# Altium schematic sheet FMC_connector.SchDoc: FMC DAC 1.5GS 4CH
size 420 x 297 mm; Author: G.Kasprowicz; CompanyName: WUT ISE; DrawnBy: G.Kasprowicz; Organization: WUT ISE; Address1: PW ISE; Address2: Nowowiejska 15/19 00-665 Warsaw; Address3: gkasprow@gmail.com; Revision: 1; SheetNumber: 18; SheetTotal: 18; ModifiedBy: -; CheckedDate: -; Title2: FMC; DivGrp: WUT ISE; Designer: G.Kasprowicz; ModifiedDate: -; ProjectName: Sensor Box
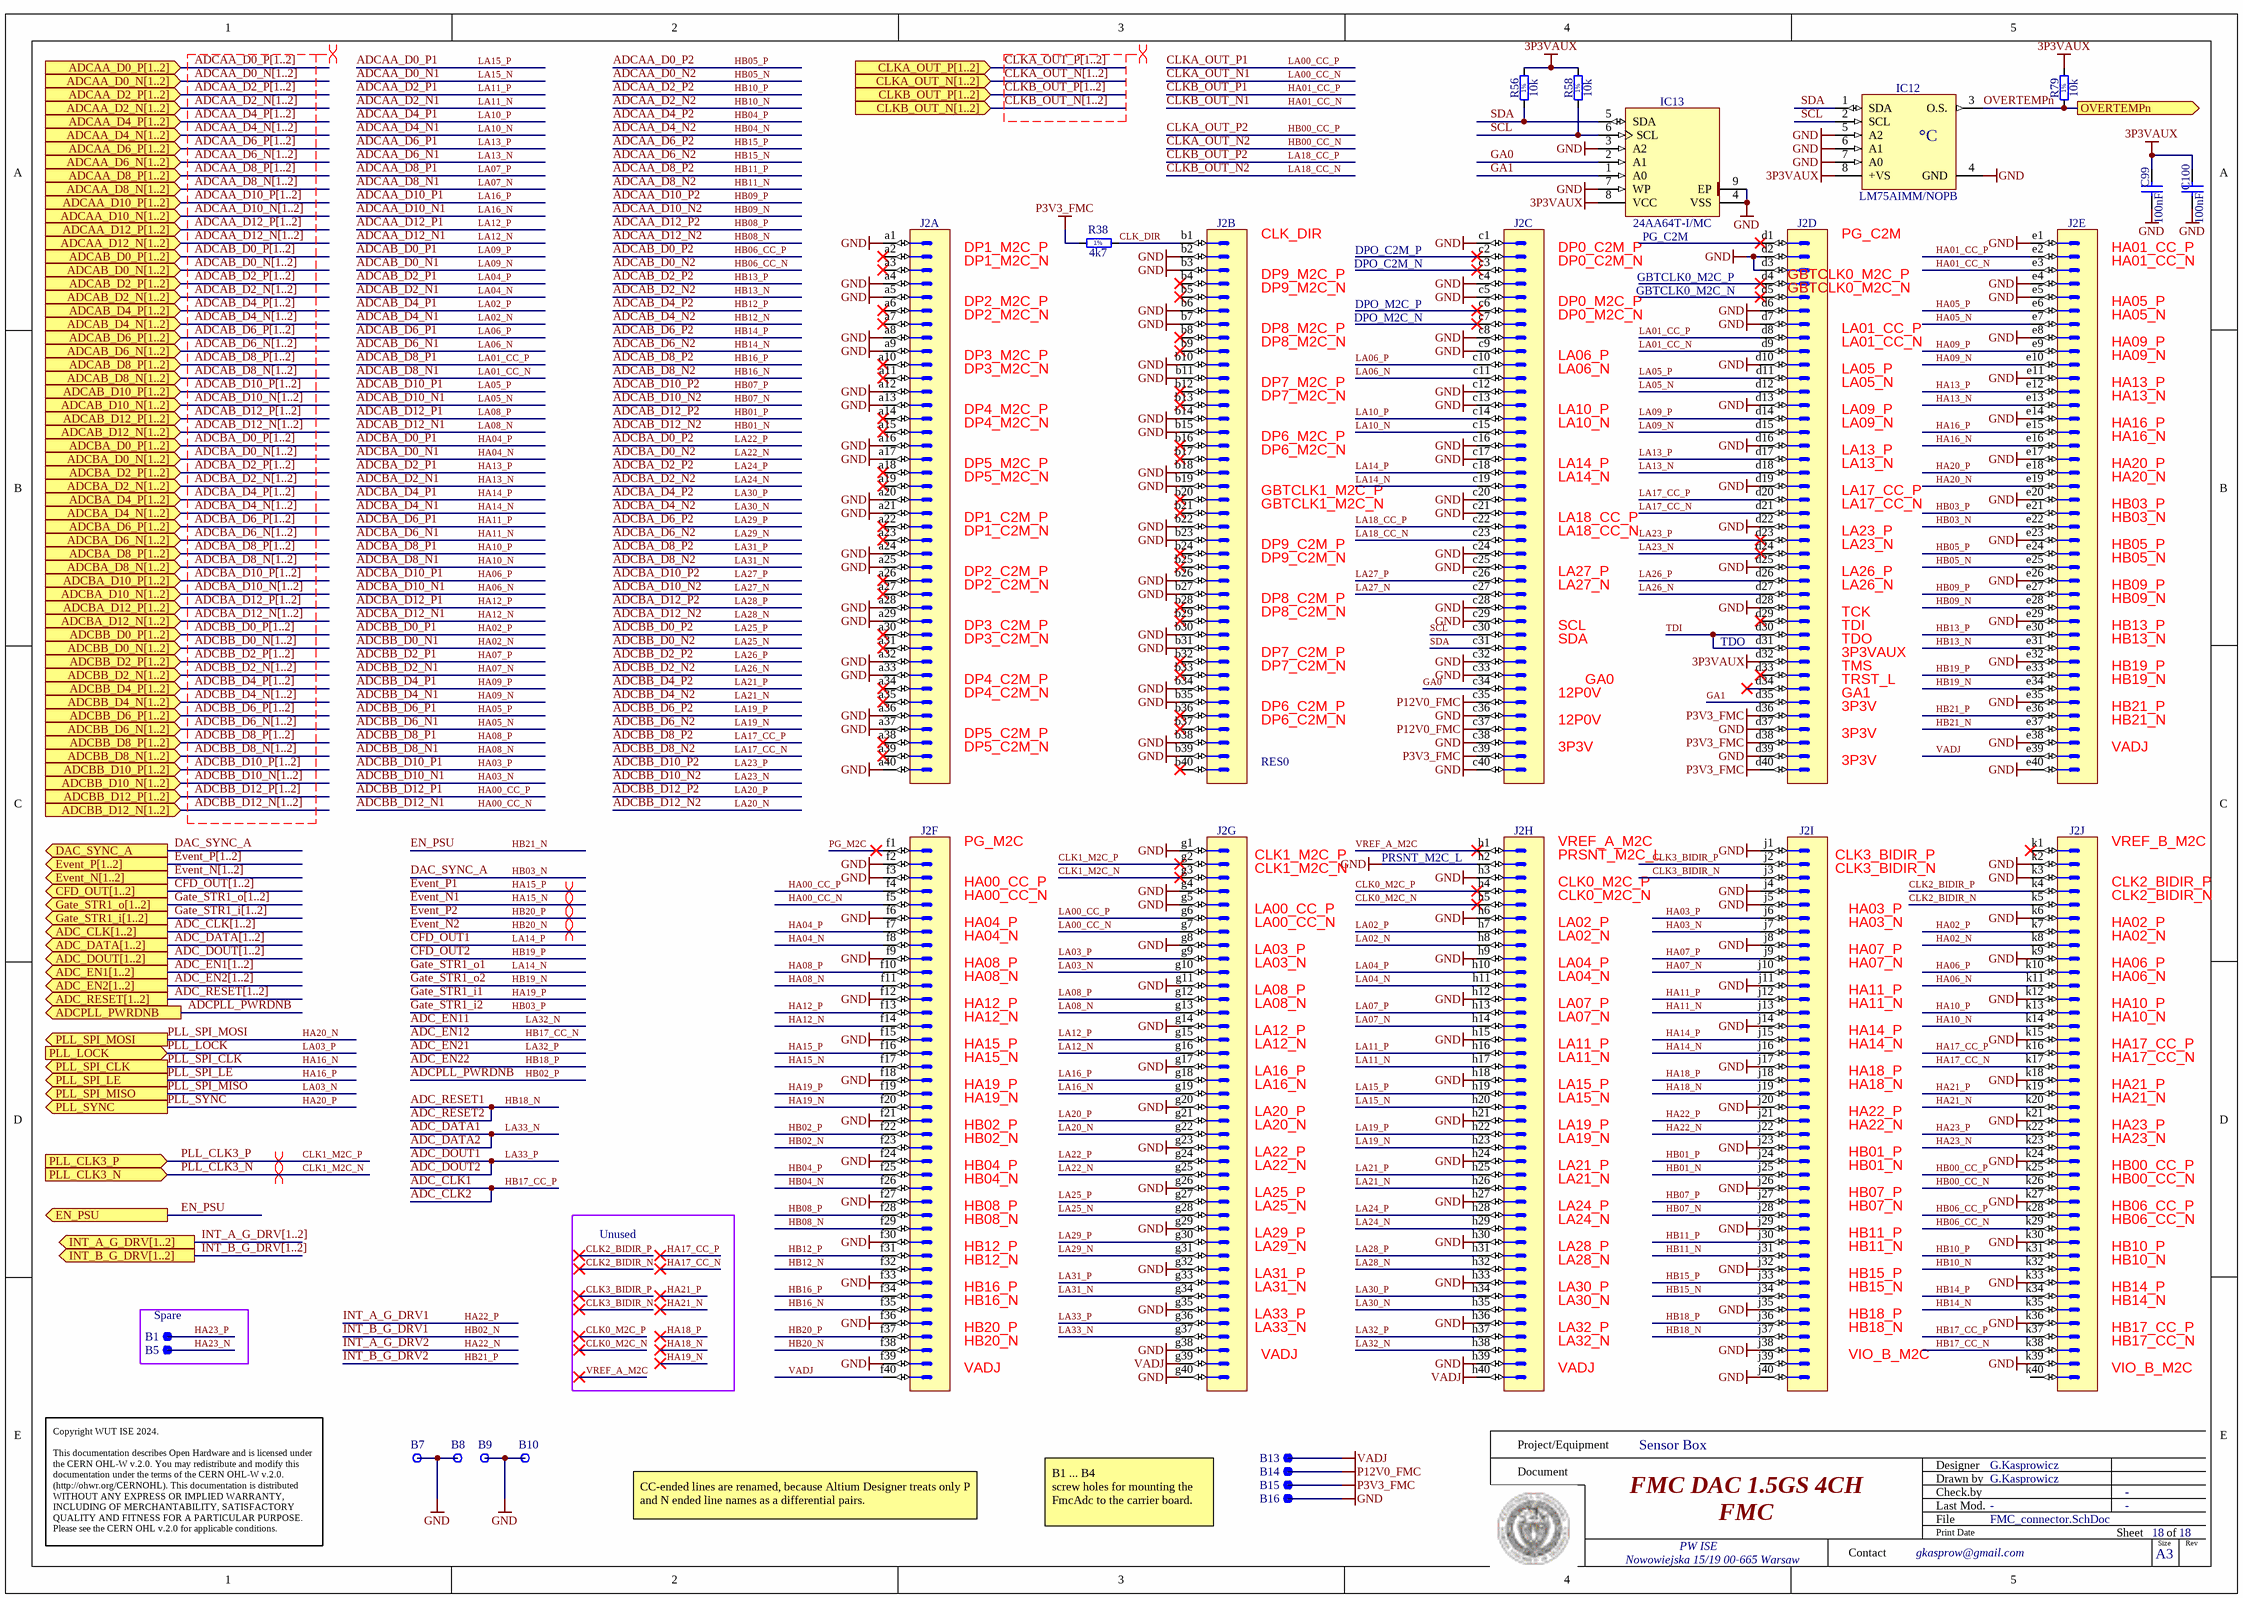
[diagram p0: FMC_connector.SchDoc]

## Parts
B1  SMD Pad  [C100]  (value not drawn)  (no BOM)
B5  SMD Pad  [C100]  (value not drawn)  (no BOM)
B7  Plated Hole  [MTG300_600]  (value not drawn)  (no BOM)
B8  Plated Hole  [MTG300_600]  (value not drawn)  (no BOM)
B9  Plated Hole  [MTG300_600]  (value not drawn)  (no BOM)
B10  Plated Hole  [MTG300_600]  (value not drawn)  (no BOM)
B13  SMD Pad  [C100]  (value not drawn)  (no BOM)
B14  SMD Pad  [C100]  (value not drawn)  (no BOM)
B15  SMD Pad  [C100]  (value not drawn)  (no BOM)
B16  SMD Pad  [C100]  (value not drawn)  (no BOM)
C99  100nF  [CAPC1005X55N]
C100  100nF  [CAPC1005X55N]
IC12  LM75AIMM/NOPB  [SOP65P490X109-8N]
IC13  24AA64T-I/MC  [SON50P300X200X100-9N-R175X155]
J2  VITA 57  [SAMTEC_ASP-134488-01]  (value not drawn)  (parts A,B,C,D,E,F,G,H,I,J of 10)
R38  4k7  [RESC1608X55N]
R56  10k  [RESC1005X40N]
R58  10k  [RESC1005X40N]
R79  10k  [RESC1005X40N]

## Blocks framed on the sheet
Spare: B1 B5

## Ports
ADC_CLK[1..2] (out), ADC_DATA[1..2] (out), ADC_DOUT[1..2] (out), ADC_EN1[1..2] (out), ADC_EN2[1..2] (out), ADC_RESET[1..2] (out), ADCAA_D0_N[1..2] (in), ADCAA_D0_P[1..2] (in), ADCAA_D2_N[1..2] (in), ADCAA_D2_P[1..2] (in), ADCAA_D4_N[1..2] (in), ADCAA_D4_P[1..2] (in), ADCAA_D6_N[1..2] (in), ADCAA_D6_P[1..2] (in), ADCAA_D8_N[1..2] (in), ADCAA_D8_P[1..2] (in), ADCAA_D10_N[1..2] (in), ADCAA_D10_P[1..2] (in), ADCAA_D12_N[1..2] (in), ADCAA_D12_P[1..2] (in), ADCAB_D0_N[1..2] (in), ADCAB_D0_P[1..2] (in), ADCAB_D2_N[1..2] (in), ADCAB_D2_P[1..2] (in), ADCAB_D4_N[1..2] (in), ADCAB_D4_P[1..2] (in), ADCAB_D6_N[1..2] (in), ADCAB_D6_P[1..2] (in), ADCAB_D8_N[1..2] (in), ADCAB_D8_P[1..2] (in), ADCAB_D10_N[1..2] (in), ADCAB_D10_P[1..2] (in), ADCAB_D12_N[1..2] (in), ADCAB_D12_P[1..2] (in), ADCBA_D0_N[1..2] (in), ADCBA_D0_P[1..2] (in), ADCBA_D2_N[1..2] (in), ADCBA_D2_P[1..2] (in), ADCBA_D4_N[1..2] (in), ADCBA_D4_P[1..2] (in), ADCBA_D6_N[1..2] (in), ADCBA_D6_P[1..2] (in), ADCBA_D8_N[1..2] (in), ADCBA_D8_P[1..2] (in), ADCBA_D10_N[1..2] (in), ADCBA_D10_P[1..2] (in), ADCBA_D12_N[1..2] (in), ADCBA_D12_P[1..2] (in), ADCBB_D0_N[1..2] (in), ADCBB_D0_P[1..2] (in), ADCBB_D2_N[1..2] (in), ADCBB_D2_P[1..2] (in), ADCBB_D4_N[1..2] (in), ADCBB_D4_P[1..2] (in), ADCBB_D6_N[1..2] (in), ADCBB_D6_P[1..2] (in), ADCBB_D8_N[1..2] (in), ADCBB_D8_P[1..2] (in), ADCBB_D10_N[1..2] (in), ADCBB_D10_P[1..2] (in), ADCBB_D12_N[1..2] (in), ADCBB_D12_P[1..2] (in), ADCPLL_PWRDNB (out), CFD_OUT[1..2] (out), CLKA_OUT_N[1..2] (in), CLKA_OUT_P[1..2] (in), CLKB_OUT_N[1..2] (in), CLKB_OUT_P[1..2] (in), DAC_SYNC_A (out), EN_PSU (out), Event_N[1..2] (out), Event_P[1..2] (out), Gate_STR1_i[1..2] (out), Gate_STR1_o[1..2] (out), INT_A_G_DRV[1..2] (out), INT_B_G_DRV[1..2] (out), OVERTEMPn (out), PLL_CLK3_N (in), PLL_CLK3_P (in), PLL_LOCK (in), PLL_SPI_CLK (out), PLL_SPI_LE (out), PLL_SPI_MISO (out), PLL_SPI_MOSI (out), PLL_SYNC (out)

## Nets
3P3VAUX: C99.2 C100.2 IC12.8(+VS) IC13.8(VCC) J2.d32 R56.2 R58.2 R79.2
GND: B7.1 B8.1 B9.1 B10.1 B16.1 C99.1 C100.1 IC12.4(GND) IC12.5(A2) IC12.6(A1) IC12.7(A0) IC13.3(A2) IC13.4(VSS) IC13.7(WP) IC13.9(EP) J2.a1 J2.a4 J2.a5 J2.a8 J2.a9 J2.a12 J2.a13 J2.a16 J2.a17 J2.a20 J2.a21 J2.a24 J2.a25 J2.a28 J2.a29 J2.a32 J2.a33 J2.a36 J2.a37 J2.a40 J2.b2 J2.b3 J2.b6 J2.b7 J2.b10 J2.b11 J2.b14 J2.b15 J2.b18 J2.b19 J2.b22 J2.b23 J2.b26 J2.b27 J2.b30 J2.b31 J2.b34 J2.b35 J2.b38 J2.b39 J2.c1 J2.c4 J2.c5 J2.c8 J2.c9 J2.c12 J2.c13 J2.c16 J2.c17 J2.c20 J2.c21 J2.c24 J2.c25 J2.c28 J2.c29 J2.c32 J2.c33 J2.c36 J2.c38 J2.c40 J2.d2 J2.d3 J2.d6 J2.d7 J2.d10 J2.d13 J2.d16 J2.d19 J2.d22 J2.d25 J2.d28 J2.d37 J2.d39 J2.e1 J2.e4 J2.e5 J2.e8 J2.e11 J2.e14 J2.e17 J2.e20 J2.e23 J2.e26 J2.e29 J2.e32 J2.e35 J2.e38 J2.e40 J2.f2 J2.f3 J2.f6 J2.f9 J2.f12 J2.f15 J2.f18 J2.f21 J2.f24 J2.f27 J2.f30 J2.f33 J2.f36 J2.f39 J2.g1 J2.g4 J2.g5 J2.g8 J2.g11 J2.g14 J2.g17 J2.g20 J2.g23 J2.g26 J2.g29 J2.g32 J2.g35 J2.g38 J2.g40 J2.h2 J2.h3 J2.h6 J2.h9 J2.h12 J2.h15 J2.h18 J2.h21 J2.h24 J2.h27 J2.h30 J2.h33 J2.h36 J2.h39 J2.j1 J2.j4 J2.j5 J2.j8 J2.j11 J2.j14 J2.j17 J2.j20 J2.j23 J2.j26 J2.j29 J2.j32 J2.j35 J2.j38 J2.j40 J2.k2 J2.k3 J2.k6 J2.k9 J2.k12 J2.k15 J2.k18 J2.k21 J2.k24 J2.k27 J2.k30 J2.k33 J2.k36 J2.k39
P3V3_FMC: B15.1 J2.c39 J2.d36 J2.d38 J2.d40 R38.1
P12V0_FMC: B14.1 J2.c35 J2.c37
VADJ: B13.1 J2.e39 J2.f40 J2.g39 J2.h40
ADC_CLK1: J2.k37  [also labelled ADC_CLK2, HB17_CC_P]
ADC_DATA1: J2.g37  [also labelled ADC_DATA2, LA33_N]
ADC_DOUT1: J2.g36  [also labelled ADC_DOUT2, LA33_P]
ADC_EN11: J2.h38  [also labelled LA32_N]
ADC_EN12: J2.k38  [also labelled HB17_CC_N]
ADC_EN21: J2.h37  [also labelled LA32_P]
ADC_EN22: J2.j36  [also labelled HB18_P]
ADC_RESET1: J2.j37  [also labelled ADC_RESET2, HB18_N]
ADCAA_D0_N1: J2.h20  [also labelled LA15_N]
ADCAA_D0_N2: J2.e25  [also labelled HB05_N]
ADCAA_D0_P1: J2.h19  [also labelled LA15_P]
ADCAA_D0_P2: J2.e24  [also labelled HB05_P]
ADCAA_D2_N1: J2.h17  [also labelled LA11_N]
ADCAA_D2_N2: J2.k32  [also labelled HB10_N]
ADCAA_D2_P1: J2.h16  [also labelled LA11_P]
ADCAA_D2_P2: J2.k31  [also labelled HB10_P]
ADCAA_D4_N1: J2.c15  [also labelled LA10_N]
ADCAA_D4_N2: J2.f26  [also labelled HB04_N]
ADCAA_D4_P1: J2.c14  [also labelled LA10_P]
ADCAA_D4_P2: J2.f25  [also labelled HB04_P]
ADCAA_D6_N1: J2.d18  [also labelled LA13_N]
ADCAA_D6_N2: J2.j34  [also labelled HB15_N]
ADCAA_D6_P1: J2.d17  [also labelled LA13_P]
ADCAA_D6_P2: J2.j33  [also labelled HB15_P]
ADCAA_D8_N1: J2.h14  [also labelled LA07_N]
ADCAA_D8_N2: J2.j31  [also labelled HB11_N]
ADCAA_D8_P1: J2.h13  [also labelled LA07_P]
ADCAA_D8_P2: J2.j30  [also labelled HB11_P]
ADCAA_D10_N1: J2.g19  [also labelled LA16_N]
ADCAA_D10_N2: J2.e28  [also labelled HB09_N]
ADCAA_D10_P1: J2.g18  [also labelled LA16_P]
ADCAA_D10_P2: J2.e27  [also labelled HB09_P]
ADCAA_D12_N1: J2.g16  [also labelled LA12_N]
ADCAA_D12_N2: J2.f29  [also labelled HB08_N]
ADCAA_D12_P1: J2.g15  [also labelled LA12_P]
ADCAA_D12_P2: J2.f28  [also labelled HB08_P]
ADCAB_D0_N1: J2.d15  [also labelled LA09_N]
ADCAB_D0_N2: J2.k29  [also labelled HB06_CC_N]
ADCAB_D0_P1: J2.d14  [also labelled LA09_P]
ADCAB_D0_P2: J2.k28  [also labelled HB06_CC_P]
ADCAB_D2_N1: J2.h11  [also labelled LA04_N]
ADCAB_D2_N2: J2.e31  [also labelled HB13_N]
ADCAB_D2_P1: J2.h10  [also labelled LA04_P]
ADCAB_D2_P2: J2.e30  [also labelled HB13_P]
ADCAB_D4_N1: J2.h8  [also labelled LA02_N]
ADCAB_D4_N2: J2.f32  [also labelled HB12_N]
ADCAB_D4_P1: J2.h7  [also labelled LA02_P]
ADCAB_D4_P2: J2.f31  [also labelled HB12_P]
ADCAB_D6_N1: J2.c11  [also labelled LA06_N]
ADCAB_D6_N2: J2.k35  [also labelled HB14_N]
ADCAB_D6_P1: J2.c10  [also labelled LA06_P]
ADCAB_D6_P2: J2.k34  [also labelled HB14_P]
ADCAB_D8_N1: J2.d9  [also labelled LA01_CC_N]
ADCAB_D8_N2: J2.f35  [also labelled HB16_N]
ADCAB_D8_P1: J2.d8  [also labelled LA01_CC_P]
ADCAB_D8_P2: J2.f34  [also labelled HB16_P]
ADCAB_D10_N1: J2.d12  [also labelled LA05_N]
ADCAB_D10_N2: J2.j28  [also labelled HB07_N]
ADCAB_D10_P1: J2.d11  [also labelled LA05_P]
ADCAB_D10_P2: J2.j27  [also labelled HB07_P]
ADCAB_D12_N1: J2.g13  [also labelled LA08_N]
ADCAB_D12_N2: J2.j25  [also labelled HB01_N]
ADCAB_D12_P1: J2.g12  [also labelled LA08_P]
ADCAB_D12_P2: J2.j24  [also labelled HB01_P]
ADCBA_D0_N1: J2.f8  [also labelled HA04_N]
ADCBA_D0_N2: J2.g25  [also labelled LA22_N]
ADCBA_D0_P1: J2.f7  [also labelled HA04_P]
ADCBA_D0_P2: J2.g24  [also labelled LA22_P]
ADCBA_D2_N1: J2.e13  [also labelled HA13_N]
ADCBA_D2_N2: J2.h29  [also labelled LA24_N]
ADCBA_D2_P1: J2.e12  [also labelled HA13_P]
ADCBA_D2_P2: J2.h28  [also labelled LA24_P]
ADCBA_D4_N1: J2.j16  [also labelled HA14_N]
ADCBA_D4_N2: J2.h35  [also labelled LA30_N]
ADCBA_D4_P1: J2.j15  [also labelled HA14_P]
ADCBA_D4_P2: J2.h34  [also labelled LA30_P]
ADCBA_D6_N1: J2.j13  [also labelled HA11_N]
ADCBA_D6_N2: J2.g31  [also labelled LA29_N]
ADCBA_D6_P1: J2.j12  [also labelled HA11_P]
ADCBA_D6_P2: J2.g30  [also labelled LA29_P]
ADCBA_D8_N1: J2.k14  [also labelled HA10_N]
ADCBA_D8_N2: J2.g34  [also labelled LA31_N]
ADCBA_D8_P1: J2.k13  [also labelled HA10_P]
ADCBA_D8_P2: J2.g33  [also labelled LA31_P]
ADCBA_D10_N1: J2.k11  [also labelled HA06_N]
ADCBA_D10_N2: J2.c27  [also labelled LA27_N]
ADCBA_D10_P1: J2.k10  [also labelled HA06_P]
ADCBA_D10_P2: J2.c26  [also labelled LA27_P]
ADCBA_D12_N1: J2.f14  [also labelled HA12_N]
ADCBA_D12_N2: J2.h32  [also labelled LA28_N]
ADCBA_D12_P1: J2.f13  [also labelled HA12_P]
ADCBA_D12_P2: J2.h31  [also labelled LA28_P]
ADCBB_D0_N1: J2.k8  [also labelled HA02_N]
ADCBB_D0_N2: J2.g28  [also labelled LA25_N]
ADCBB_D0_P1: J2.k7  [also labelled HA02_P]
ADCBB_D0_P2: J2.g27  [also labelled LA25_P]
ADCBB_D2_N1: J2.j10  [also labelled HA07_N]
ADCBB_D2_N2: J2.d27  [also labelled LA26_N]
ADCBB_D2_P1: J2.j9  [also labelled HA07_P]
ADCBB_D2_P2: J2.d26  [also labelled LA26_P]
ADCBB_D4_N1: J2.e10  [also labelled HA09_N]
ADCBB_D4_N2: J2.h26  [also labelled LA21_N]
ADCBB_D4_P1: J2.e9  [also labelled HA09_P]
ADCBB_D4_P2: J2.h25  [also labelled LA21_P]
ADCBB_D6_N1: J2.e7  [also labelled HA05_N]
ADCBB_D6_N2: J2.h23  [also labelled LA19_N]
ADCBB_D6_P1: J2.e6  [also labelled HA05_P]
ADCBB_D6_P2: J2.h22  [also labelled LA19_P]
ADCBB_D8_N1: J2.f11  [also labelled HA08_N]
ADCBB_D8_N2: J2.d21  [also labelled LA17_CC_N]
ADCBB_D8_P1: J2.f10  [also labelled HA08_P]
ADCBB_D8_P2: J2.d20  [also labelled LA17_CC_P]
ADCBB_D10_N1: J2.j7  [also labelled HA03_N]
ADCBB_D10_N2: J2.d24  [also labelled LA23_N]
ADCBB_D10_P1: J2.j6  [also labelled HA03_P]
ADCBB_D10_P2: J2.d23  [also labelled LA23_P]
ADCBB_D12_N1: J2.f5  [also labelled HA00_CC_N]
ADCBB_D12_N2: J2.g22  [also labelled LA20_N]
ADCBB_D12_P1: J2.f4  [also labelled HA00_CC_P]
ADCBB_D12_P2: J2.g21  [also labelled LA20_P]
ADCPLL_PWRDNB: J2.f22 ; port ADCPLL_PWRDNB  [also labelled HB02_P]
CFD_OUT1: J2.c18  [also labelled LA14_P]
CFD_OUT2: J2.e33  [also labelled HB19_P]
CLK0_M2C_N: J2.h5
CLK0_M2C_P: J2.h4
CLK1_M2C_N: J2.g3 ; port PLL_CLK3_N  [also labelled PLL_CLK3_N]
CLK1_M2C_P: J2.g2 ; port PLL_CLK3_P  [also labelled PLL_CLK3_P]
CLK2_BIDIR_N: J2.k5
CLK2_BIDIR_P: J2.k4
CLK3_BIDIR_N: J2.j3
CLK3_BIDIR_P: J2.j2
CLK_DIR: J2.b1 R38.2
CLKA_OUT_N1: J2.g7  [also labelled LA00_CC_N]
CLKA_OUT_N2: J2.k26  [also labelled HB00_CC_N]
CLKA_OUT_P1: J2.g6  [also labelled LA00_CC_P]
CLKA_OUT_P2: J2.k25  [also labelled HB00_CC_P]
CLKB_OUT_N1: J2.e3  [also labelled HA01_CC_N]
CLKB_OUT_N2: J2.c23  [also labelled LA18_CC_N]
CLKB_OUT_P1: J2.e2  [also labelled HA01_CC_P]
CLKB_OUT_P2: J2.c22  [also labelled LA18_CC_P]
DAC_SYNC_A: J2.e22 ; port DAC_SYNC_A  [also labelled HB03_N]
EN_PSU: J2.e37 ; port EN_PSU  [also labelled HB21_N]
Event_N1: J2.f17  [also labelled HA15_N]
Event_N2: J2.f38  [also labelled HB20_N]
Event_P1: J2.f16  [also labelled HA15_P]
Event_P2: J2.f37  [also labelled HB20_P]
GA0: IC13.2(A1) J2.c34
GA1: IC13.1(A0) J2.d35
Gate_STR1_i1: J2.f19  [also labelled HA19_P]
Gate_STR1_i2: J2.e21  [also labelled HB03_P]
Gate_STR1_o1: J2.c19  [also labelled LA14_N]
Gate_STR1_o2: J2.e34  [also labelled HB19_N]
HA16_N: J2.e16 ; port PLL_SPI_CLK  [also labelled PLL_SPI_CLK]
HA16_P: J2.e15 ; port PLL_SPI_LE  [also labelled PLL_SPI_LE]
HA17_CC_N: J2.k17
HA17_CC_P: J2.k16
HA18_N: J2.j19
HA18_P: J2.j18
HA19_N: J2.f20
HA20_N: J2.e19 ; port PLL_SPI_MOSI  [also labelled PLL_SPI_MOSI]
HA20_P: J2.e18 ; port PLL_SYNC  [also labelled PLL_SYNC]
HA21_N: J2.k20
HA21_P: J2.k19
HA22_N: J2.j22  [also labelled INT_A_G_DRV2]
HA22_P: J2.j21  [also labelled INT_A_G_DRV1]
HA23_N: B5.1 J2.k23
HA23_P: B1.1 J2.k22
HB02_N: J2.f23  [also labelled INT_B_G_DRV1]
HB21_P: J2.e36  [also labelled INT_B_G_DRV2]
LA03_N: J2.g10 ; port PLL_SPI_MISO  [also labelled PLL_SPI_MISO]
LA03_P: J2.g9 ; port PLL_LOCK  [also labelled PLL_LOCK]
OVERTEMPn: IC12.3(O.S.) R79.1 ; port OVERTEMPn
PG_M2C: J2.f1
SCL: IC12.2(SCL) IC13.6(SCL) J2.c30 R58.1
SDA: IC12.1(SDA) IC13.5(SDA) J2.c31 R56.1
TDI: J2.d30 J2.d31
VREF_A_M2C: J2.h1

Not connected (* = marked no-connect by the designer): J2 a2* a3* a6* a7* a10* a11* a14* a15* a18* a19* a22* a23* a26* a27* a30* a31* a34* a35* a38* a39* b4* b5* b8* b9* b12* b13* b16* b17* b20* b21* b24* b25* b28* b29* b32* b33* b36* b37* b40* c2* c3* c6* c7* d1* d4* d5* d29* d33* d34* j39 k1* k40

## Buses and harness runs
bus ADC_CLK[1..2] = port ADC_CLK[1..2]
bus ADC_DATA[1..2] = port ADC_DATA[1..2]
bus ADC_DOUT[1..2] = port ADC_DOUT[1..2]
bus ADC_EN1[1..2] = port ADC_EN1[1..2]
bus ADC_EN2[1..2] = port ADC_EN2[1..2]
bus ADC_RESET[1..2] = port ADC_RESET[1..2]
bus ADCAA_D0_N[1..2] = port ADCAA_D0_N[1..2]
bus ADCAA_D0_P[1..2] = port ADCAA_D0_P[1..2]
bus ADCAA_D2_N[1..2] = port ADCAA_D2_N[1..2]
bus ADCAA_D2_P[1..2] = port ADCAA_D2_P[1..2]
bus ADCAA_D4_N[1..2] = port ADCAA_D4_N[1..2]
bus ADCAA_D4_P[1..2] = port ADCAA_D4_P[1..2]
bus ADCAA_D6_N[1..2] = port ADCAA_D6_N[1..2]
bus ADCAA_D6_P[1..2] = port ADCAA_D6_P[1..2]
bus ADCAA_D8_N[1..2] = port ADCAA_D8_N[1..2]
bus ADCAA_D8_P[1..2] = port ADCAA_D8_P[1..2]
bus ADCAA_D10_N[1..2] = port ADCAA_D10_N[1..2]
bus ADCAA_D10_P[1..2] = port ADCAA_D10_P[1..2]
bus ADCAA_D12_N[1..2] = port ADCAA_D12_N[1..2]
bus ADCAA_D12_P[1..2] = port ADCAA_D12_P[1..2]
bus ADCAB_D0_N[1..2] = port ADCAB_D0_N[1..2]
bus ADCAB_D0_P[1..2] = port ADCAB_D0_P[1..2]
bus ADCAB_D2_N[1..2] = port ADCAB_D2_N[1..2]
bus ADCAB_D2_P[1..2] = port ADCAB_D2_P[1..2]
bus ADCAB_D4_N[1..2] = port ADCAB_D4_N[1..2]
bus ADCAB_D4_P[1..2] = port ADCAB_D4_P[1..2]
bus ADCAB_D6_N[1..2] = port ADCAB_D6_N[1..2]
bus ADCAB_D6_P[1..2] = port ADCAB_D6_P[1..2]
bus ADCAB_D8_N[1..2] = port ADCAB_D8_N[1..2]
bus ADCAB_D8_P[1..2] = port ADCAB_D8_P[1..2]
bus ADCAB_D10_N[1..2] = port ADCAB_D10_N[1..2]
bus ADCAB_D10_P[1..2] = port ADCAB_D10_P[1..2]
bus ADCAB_D12_N[1..2] = port ADCAB_D12_N[1..2]
bus ADCAB_D12_P[1..2] = port ADCAB_D12_P[1..2]
bus ADCBA_D0_N[1..2] = port ADCBA_D0_N[1..2]
bus ADCBA_D0_P[1..2] = port ADCBA_D0_P[1..2]
bus ADCBA_D2_N[1..2] = port ADCBA_D2_N[1..2]
bus ADCBA_D2_P[1..2] = port ADCBA_D2_P[1..2]
bus ADCBA_D4_N[1..2] = port ADCBA_D4_N[1..2]
bus ADCBA_D4_P[1..2] = port ADCBA_D4_P[1..2]
bus ADCBA_D6_N[1..2] = port ADCBA_D6_N[1..2]
bus ADCBA_D6_P[1..2] = port ADCBA_D6_P[1..2]
bus ADCBA_D8_N[1..2] = port ADCBA_D8_N[1..2]
bus ADCBA_D8_P[1..2] = port ADCBA_D8_P[1..2]
bus ADCBA_D10_N[1..2] = port ADCBA_D10_N[1..2]
bus ADCBA_D10_P[1..2] = port ADCBA_D10_P[1..2]
bus ADCBA_D12_N[1..2] = port ADCBA_D12_N[1..2]
bus ADCBA_D12_P[1..2] = port ADCBA_D12_P[1..2]
bus ADCBB_D0_N[1..2] = port ADCBB_D0_N[1..2]
bus ADCBB_D0_P[1..2] = port ADCBB_D0_P[1..2]
bus ADCBB_D2_N[1..2] = port ADCBB_D2_N[1..2]
bus ADCBB_D2_P[1..2] = port ADCBB_D2_P[1..2]
bus ADCBB_D4_N[1..2] = port ADCBB_D4_N[1..2]
bus ADCBB_D4_P[1..2] = port ADCBB_D4_P[1..2]
bus ADCBB_D6_N[1..2] = port ADCBB_D6_N[1..2]
bus ADCBB_D6_P[1..2] = port ADCBB_D6_P[1..2]
bus ADCBB_D8_N[1..2] = port ADCBB_D8_N[1..2]
bus ADCBB_D8_P[1..2] = port ADCBB_D8_P[1..2]
bus ADCBB_D10_N[1..2] = port ADCBB_D10_N[1..2]
bus ADCBB_D10_P[1..2] = port ADCBB_D10_P[1..2]
bus ADCBB_D12_N[1..2] = port ADCBB_D12_N[1..2]
bus ADCBB_D12_P[1..2] = port ADCBB_D12_P[1..2]
bus CFD_OUT[1..2] = port CFD_OUT[1..2]
bus CLKA_OUT_N[1..2] = port CLKA_OUT_N[1..2]
bus CLKA_OUT_P[1..2] = port CLKA_OUT_P[1..2]
bus CLKB_OUT_N[1..2] = port CLKB_OUT_N[1..2]
bus CLKB_OUT_P[1..2] = port CLKB_OUT_P[1..2]
bus Event_N[1..2] = port Event_N[1..2]
bus Event_P[1..2] = port Event_P[1..2]
bus Gate_STR1_i[1..2] = port Gate_STR1_i[1..2]
bus Gate_STR1_o[1..2] = port Gate_STR1_o[1..2]
bus INT_A_G_DRV[1..2] = port INT_A_G_DRV[1..2]
bus INT_B_G_DRV[1..2] = port INT_B_G_DRV[1..2]

## Layout directives
differential pair; differential pair class D100: ADCAA_D0_N[1..2], ADCAA_D0_P[1..2], ADCAA_D2_N[1..2], ADCAA_D2_P[1..2], ADCAA_D4_N[1..2], ADCAA_D4_P[1..2], ADCAA_D6_N[1..2], ADCAA_D6_P[1..2], ADCAA_D8_N[1..2], ADCAA_D8_P[1..2], ADCAA_D10_N[1..2], ADCAA_D10_P[1..2], ADCAA_D12_N[1..2], ADCAA_D12_P[1..2], ADCAB_D0_N[1..2], ADCAB_D0_P[1..2], ADCAB_D2_N[1..2], ADCAB_D2_P[1..2], ADCAB_D4_N[1..2], ADCAB_D4_P[1..2], ADCAB_D6_N[1..2], ADCAB_D6_P[1..2], ADCAB_D8_N[1..2], ADCAB_D8_P[1..2], ADCAB_D10_N[1..2], ADCAB_D10_P[1..2], ADCAB_D12_N[1..2], ADCAB_D12_P[1..2], ADCBA_D0_N[1..2], ADCBA_D0_P[1..2], ADCBA_D2_N[1..2], ADCBA_D2_P[1..2], ADCBA_D4_N[1..2], ADCBA_D4_P[1..2], ADCBA_D6_N[1..2], ADCBA_D6_P[1..2], ADCBA_D8_N[1..2], ADCBA_D8_P[1..2], ADCBA_D10_N[1..2], ADCBA_D10_P[1..2], ADCBA_D12_N[1..2], ADCBA_D12_P[1..2], ADCBB_D0_N[1..2], ADCBB_D0_P[1..2], ADCBB_D2_N[1..2], ADCBB_D2_P[1..2], ADCBB_D4_N[1..2], ADCBB_D4_P[1..2], ADCBB_D6_N[1..2], ADCBB_D6_P[1..2], ADCBB_D8_N[1..2], ADCBB_D8_P[1..2], ADCBB_D10_N[1..2], ADCBB_D10_P[1..2], ADCBB_D12_N[1..2], ADCBB_D12_P[1..2], CLK1_M2C_N, CLK1_M2C_P, CLKA_OUT_N[1..2], CLKA_OUT_P[1..2], CLKB_OUT_N[1..2], CLKB_OUT_P[1..2], Event_N1, Event_N2, Event_P1, Event_P2

## Notes on the sheet
- DP1_M2C_P
- DP1_M2C_N
- CLK_DIR
- DPO_C2M_P
- DPO_C2M_N
- DP0_C2M_P
- DP0_C2M_N
- (near IC13) PG_C2M
- GBTCLK0_M2C_P
- PG_C2M
- HA01_CC_P
- HA01_CC_N
- DP2_M2C_P
- DP2_M2C_N
- DP9_M2C_P
- DP9_M2C_N
- DP8_M2C_P
- DPO_M2C_P
- DPO_M2C_N
- DP0_M2C_P
- DP0_M2C_N
- GBTCLK0_M2C_N
- (near J2) GBTCLK0_M2C_P
- (near J2) GBTCLK0_M2C_N
- LA01_CC_P
- HA05_P
- HA05_N
- DP3_M2C_P
- DP3_M2C_N
- DP8_M2C_N
- DP7_M2C_P
- DP7_M2C_N
- LA06_P
- LA06_N
- LA01_CC_N
- LA05_P
- LA05_N
- HA09_P
- HA09_N
- HA13_P
- HA13_N
- DP4_M2C_P
- DP4_M2C_N
- DP5_M2C_P
- DP6_M2C_P
- DP6_M2C_N
- LA10_P
- LA10_N
- LA14_P
- LA09_P
- LA09_N
- LA13_P
- LA13_N
- HA16_P
- HA16_N
- HA20_P
- DP5_M2C_N
- DP1_C2M_P
- DP1_C2M_N
- GBTCLK1_M2C_P
- GBTCLK1_M2C_N
- LA14_N
- LA18_CC_P
- LA18_CC_N
- LA17_CC_P
- LA17_CC_N
- LA23_P
- HA20_N
- HB03_P
- HB03_N
- DP2_C2M_P
- DP2_C2M_N
- DP9_C2M_P
- DP9_C2M_N
- DP8_C2M_P
- LA27_P
- LA27_N
- LA23_N
- LA26_P
- LA26_N
- HB05_P
- HB05_N
- HB09_P
- HB09_N
- DP3_C2M_P
- DP3_C2M_N
- DP8_C2M_N
- DP7_C2M_P
- DP7_C2M_N
- SCL
- SDA
- (near J2) TDO
- TCK
- TDI
- TDO
- 3P3VAUX
- TMS
- HB13_P
- HB13_N
- HB19_P
- DP4_C2M_P
- DP4_C2M_N
- DP5_C2M_P
- DP6_C2M_P
- DP6_C2M_N
- 12P0V
- GA0
- TRST_L
- GA1
- 3P3V
- HB19_N
- HB21_P
- HB21_N
- DP5_C2M_N
- RES0
- VADJ
- PG_M2C
- (near J2) CLK1_M2C_P
- (near J2) CLK1_M2C_N
- (near J2) PRSNT_M2C_L
- VREF_A_M2C
- PRSNT_M2C_L
- (near J2) CLK3_BIDIR_P
- (near J2) CLK3_BIDIR_N
- VREF_B_M2C
- HA00_CC_P
- HA00_CC_N
- HA04_P
- HA04_N
- (near J2) LA00_CC_P
- (near J2) LA00_CC_N
- CLK0_M2C_P
- CLK0_M2C_N
- LA02_P
- LA02_N
- HA03_P
- HA03_N
- CLK2_BIDIR_P
- CLK2_BIDIR_N
- HA02_P
- HA02_N
- HA08_P
- HA08_N
- HA12_P
- (near J2) LA03_P
- (near J2) LA03_N
- (near J2) LA08_P
- (near J2) LA08_N
- LA04_P
- LA04_N
- LA07_P
- HA07_P
- HA07_N
- HA11_P
- HA11_N
- HA06_P
- HA06_N
- HA10_P
- HA12_N
- HA15_P
- HA15_N
- (near J2) LA12_P
- (near J2) LA12_N
- (near J2) LA16_P
- LA07_N
- LA11_P
- LA11_N
- HA14_P
- HA14_N
- HA18_P
- HA10_N
- HA17_CC_P
- HA17_CC_N
- HA19_P
- HA19_N
- HB02_P
- HB02_N
- (near J2) LA16_N
- (near J2) LA20_P
- (near J2) LA20_N
- LA15_P
- LA15_N
- LA19_P
- LA19_N
- HA18_N
- HA22_P
- HA22_N
- HA21_P
- HA21_N
- HA23_P
- HA23_N
- HB04_P
- HB04_N
- HB08_P
- (near J2) LA22_P
- (near J2) LA22_N
- (near J2) LA25_P
- (near J2) LA25_N
- LA21_P
- LA21_N
- LA24_P
- HB01_P
- HB01_N
- HB07_P
- HB07_N
- HB00_CC_P
- HB00_CC_N
- HB06_CC_P
- Unused
- HB08_N
- HB12_P
- HB12_N
- (near J2) LA29_P
- (near J2) LA29_N
- (near J2) LA31_P
- LA24_N
- LA28_P
- LA28_N
- HB11_P
- HB11_N
- HB15_P
- HB06_CC_N
- HB10_P
- HB10_N
- HB16_P
- HB16_N
- HB20_P
- HB20_N
- (near J2) LA31_N
- (near J2) LA33_P
- (near J2) LA33_N
- LA30_P
- LA30_N
- LA32_P
- LA32_N
- HB15_N
- HB18_P
- HB18_N
- HB14_P
- HB14_N
- HB17_CC_P
- HB17_CC_N
- VIO_B_M2C
- CC-ended lines are renamed, because Altium Designer treats only P and N ended line names as a differential pairs.
- B1 ... B4
  screw holes for mounting the FmcAdc to the carrier board.
- Project/Equipment
- Document
- Designer
- Drawn by
- Check.by
- Copyright WUT ISE 2024.
  This documentation describes Open Hardware and is licensed under the CERN OHL-W v.2.0. You may redistribute and modify this documentation under the terms of the CERN OHL-W v.2.0. (http://ohwr.org/CERNOHL). This documentation is distributed WITHOUT ANY EXPRESS OR IMPLIED WARRANTY, INCLUDING OF MERCHANTABILITY, SATISFACTORY QUALITY AND FITNESS FOR A PARTICULAR PURPOSE. Please see the CERN OHL v.2.0 for applicable conditions.
- Contact
- File
- Last Mod.
- Print Date
- Sheet
- Size
- A3
- of
- Rev
- (in symbol LM75AIMM/NOPB) °C
- (in symbol R0402_10K_1%_0.0625W_100PPM) 1%
- (in symbol R0603_4K7_1%_0.1W_100PPM) 1%

## Library data of the parts
B1 B5 B13-B16 = SMD_PAD_D1MM: Pad; Part Description: 1mm Diameter SMD Pad; Mounted: No; Part Number: SMD_PAD_D1MM; Component Type: Standard (No BOM); Pin Count: 1; Family: SMD Pad; Socket: No; SMD: Yes; Sense: No; Status: None; ComponentHeight: 0mm; HelpURL: Undefined; Author: CERN DEM JLC; CreateDate: 10.10.2017; LatestRevisionDate: 10.10.2017; PackageDescription: 1mm Diameter SMD Pad
B7-B10 = PLATED_HOLE3.0_PAD6.0: Single Terminal Socket; Part Description: Plated Through Hole: Hole Dia.=3.0mm Pad Dia.=6.0mm; Mounted: No; Table: Pads; Part Number: PLATED_HOLE3.0_PAD6.0; Component Type: Standard (No BOM); Designator: Single Terminal Socket; Library Reference: Single Terminal Socket; Pin Count: 1; Family: Plated Hole; Socket: No; SMD: No; Status: None; ComponentHeight: 0mm; Author: CERN DEM JLC; CreateDate: 26.05.2008; LatestRevisionDate: 26.05.2008; PackageDescription: Plated Through Hole: Hole Dia.=3.0mm Pad Dia.=6.0mm
C99 C100 = CC0402_100NF_16V_10%_X5R: Non-polarised capacitor; Part Description: SMD Multilayer Chip Ceramic Capacitor; Manufacturer: GENERIC; Manufacturer1 Part Number: GRM155R61C104KA88D; Voltage: 16V; TC: X5R; Tolerance: ±10%; Part Number: CC0402_100NF_16V_10%_X5R; Component Kind: Standard; Component Type: Standard; Pin Count: 2; Value: 100nF; Status: None; Manufacturer Part Number: CC0402_100NF_16V_10%_X5R; Case: 0402; Mounted: Yes; Socket: No; SMD: Yes; Sense: No; Manufacturer1 Example: MURATA; Manufacturer1 ComponentHeight: 0.55mm; HelpURL: \\cern.ch\dfs\Applications\Altium\Datasheets\CC0402_X5R_MURATA_GRM.pdf; Author: CERN DEM JLC; CreateDate: 10.12.2013; LatestRevisionDate: 10.12.2013
IC12 = LM75AIMM/NOPB: Digital Temperature Sensor and Thermal Watchdog with Two-Wire Interface; Part Description: -25° to +100°C ±2°C Digital Temperature Sensor and Thermal Watchdog with Two-Wire Interface; Manufacturer: TEXAS INSTRUMENTS; Table: Sensors; Part Number: LM75AIMM/NOPB; Component Kind: Standard; Component Type: Standard; Device: LM75AIMM/NOPB; PackageDescription: SOP, 0.65mm pitch; 8 pin,3.00mm W X 3.00mm L X 1.09mm H bodyI, PC Medium Density; Manufacturer Part Number: LM75AIMM/NOPB; Pin Count: 8; Case: SSOP8; Mounted: Yes; Socket: No; SMD: Yes; ComponentHeight: 1.09mm; HelpURL: \\cern.ch\dfs\Applications\Altium\Datasheets\LM75AIMM-NOPB.pdf; Author: CERN DEM JLC; CreateDate: 2012-10-15; LatestRevisionDate: 2012-10-15
IC13 = 24AA64T-I/MC: 1.7V-5.5V 64K I2C Serial EEPROM; Part Description: 1.7V-5.5V, 64K  (8K x 8-bit) I2C Serial EEPROM; Manufacturer: MICROCHIP TECHNOLOGY; PressFit: No; Bonding: No; Part Number: 24AA64T-I/MC; Component Kind: Standard; Component Type: Standard; Device: 24AA64T-I/MC; PackageDescription: SON (DFN), 0.50mm pitch, 8 pin, 2mm X 3mm X 1.00mm H body (w/thermal tab 1.75 X 1.55mm),  IPC Medium Density; Manufacturer Part Number: 24AA64T-I/MC; Pin Count: 9; Case: DFN8; Mounted: Yes; Socket: No; SMD: Yes; Sense: No; ComponentHeight: 1mm; HelpURL: \\cern.ch\dfs\Applications\Altium\Datasheets\24AA64T-I-MC.pdf; Author: CERN DEM JLC; CreateDate: 18.11.2009; LatestRevisionDate: 24.01.2011
J2 = SAMTEC_ASP-134488-01: Connector VITA 57, 400 Male contacts in 10 row abcdefghj; Part Description: 400 contacts (10 rows abcdefghj) Surface Mount Male Connector, VITA 57 (MC-HPC-10); Manufacturer: SAMTEC; Part Number: SAMTEC_ASP-134488-01; Component Kind: Standard; Component Type: Standard; Pin Count: 400; Family: VITA 57; Mounted: Yes; Socket: No; SMD: Yes; Status: None; Manufacturer Part Number: ASP-134488-01; ComponentHeight: 6.1mm; HelpURL: \\cern.ch\dfs\Applications\Altium\Datasheets\SAMTEC_ASP-134488-01.pdf; Author: CERN DEM JLC; CreateDate: 30/04/2009; LatestRevisionDate: 17/08/2009; Table: SAMTEC
R38 = R0603_4K7_1%_0.1W_100PPM: Resistor - 1%; Part Description: General Purpose Thick Film Chip Resistor; Manufacturer: GENERIC; Manufacturer1 Part Number: NRC06F4701TRF; Power: 0.1W; TC: ±100ppm/°C; Table: Resistors SMD; Part Number: R0603_4K7_1%_0.1W_100PPM; Component Kind: Standard; Component Type: Standard; Pin Count: 2; Value: 4k7; Status: Preferred; Tolerance: ±1%; Manufacturer Part Number: R0603_4K7_1%_0.1W_100PPM; Case: 0603; Mounted: Yes; Socket: No; SMD: Yes; Manufacturer1 Example: NIC COMPONENT; Manufacturer1 ComponentHeight: 0.55mm; HelpURL: \\cern.ch\dfs\Applications\Altium\Datasheets\R0603_NIC_NRC.pdf; Author: CERN DEM JLC; CreateDate: 03/12/2007; LatestRevisionDate: 13/03/2008
R56 R58 R79 = R0402_10K_1%_0.0625W_100PPM: Resistor - 1%; Part Description: General Purpose Thick Film Chip Resistor; Manufacturer: GENERIC; Manufacturer1 Part Number: 232270671003L; TC: ±100ppm/°C; Table: Resistors SMD; Part Number: R0402_10K_1%_0.0625W_100PPM; Component Kind: Standard; Component Type: Standard; Pin Count: 2; Value: 10k; Status: Not recommended; Power: 0.0625W; Tolerance: ±1%; Manufacturer Part Number: R0402_10K_1%_0.0625W_100PPM; Case: 0402; Mounted: Yes; Socket: No; SMD: Yes; Manufacturer1 Example: YAGEO PHYCOMP; Manufacturer1 ComponentHeight: 0.4mm; HelpURL: \\cern.ch\dfs\Applications\Altium\Datasheets\R0402_Phycomp_RC0402.pdf; Author: CERN DEM JLC; CreateDate: 3/12/2007; LatestRevisionDate: 17/10/2012